# Altium schematic sheet RT723.SchDoc
size A4; SheetNumber: 5; SheetTotal: 14
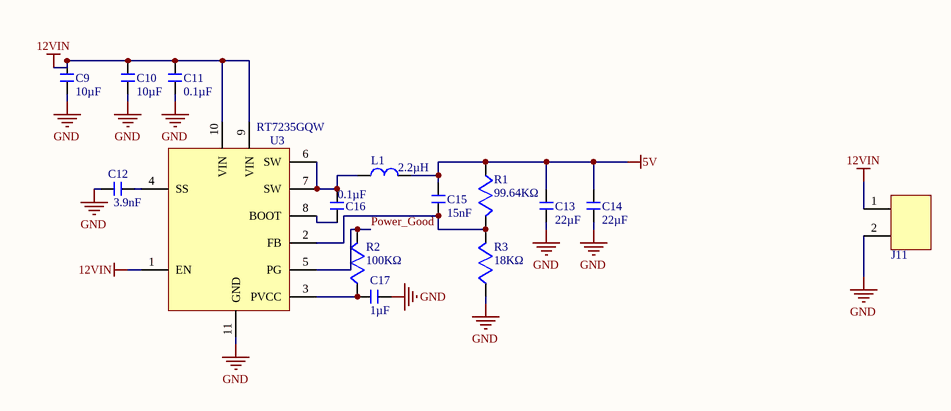
[diagram p0: RT723.SchDoc]

## Parts
C9  value 10µF  [603 CAPACITOR]  (hidden comment: 0603 CAPACİTOR)
C10  value 10µF  [603 CAPACITOR]  (hidden comment: 0603 CAPACİTOR)
C11  value 0.1µF  [402 capacitor - duplicate]  (hidden comment: 0402 capacitor)
C12  value 3.9nF  [402 capacitor - duplicate]  (hidden comment: 0402 capacitor)
C13  value 22µF  [805 Capacitor - duplicate]  (hidden comment: 0805 capacitor)
C14  value 22µF  [805 Capacitor - duplicate]  (hidden comment: 0805 capacitor)
C15  value 15nF  [402 capacitor - duplicate]  (hidden comment: 0402 capacitor)
C16  value 0.1µF  [402 capacitor - duplicate]  (hidden comment: 0402 capacitor)
C17  value 1µF  [402 capacitor - duplicate]  (hidden comment: 0402 capacitor)
J11  0901362102  [0901362102]  (value not drawn)
L1  value 2.2µH  [INDUCTOR_2]  (hidden comment: BRL2518T2R2M)
R1  value 99.64KΩ  [402 RESISTOR]  (hidden comment: 0402. RESİSTOR)
R2  value 100KΩ  [402 RESISTOR]  (hidden comment: 0402. RESİSTOR)
R3  value 18KΩ  [402 RESISTOR]  (hidden comment: 0402. RESİSTOR)
U3  RT7235GQW  [RT7235GQW]

## Nets
5V: C13.2 C14.2 C15.1 L1.2 R1.1
12VIN: C9.2 C10.2 C11.2 J11.1 U3.1(EN) U3.9(VIN) U3.10(VIN)
GND: C9.1 C10.1 C11.1 C12.2 C13.1 C14.1 C17.2 J11.2 R3.1 U3.11(GND)
Power_Good: R2.2 U3.5(PG)
NetC12_1: C12.1 U3.4(SS)
NetC15_2: C15.2 R1.2 R3.2 U3.2(FB)
NetC16_1: C16.1 L1.1 U3.6(SW) U3.7(SW)
NetC16_2: C16.2 U3.8(BOOT)
NetC17_1: C17.1 R2.1 U3.3(PVCC)

## Library data of the parts
C9 C10 = CON SMD 0603: MPN: GRM188R61E106MA73D; Pacage: 0603
C11 C16 = CAP SMD 402: MPN: CL05A104KA5NNNC; Package: 0402
C12 = CAP SMD 402: MPN: C0603C392J3GACTU; Package: 0402
C13 C14 = CAP SMD 0805: MPN: CL10A226MO7JZNC; Package: 0805
C15 = CAP SMD 402: MPN: C0402C153J5RECTU; Package: 0402
C17 = CAP SMD 402: MPN: GRM155R6YA105KE11D; Package: 0402
J11 = 0901362102: CONN HEADER R/A 2POS 2.54MM; MPN: 0901362102
L1 = BRL2518T2R2M: FIXED IND 2.2UH 850MA 175.5 MOHM; MPN: BRL2518T2R2M
R1 = RES SMD 0402: Package: 0402
R2 = RES SMD 0402: MPN: ERJ-2RKF1003X; Package: 0402
R3 = RES SMD 0402: MPN: ERA-2AEB183X; Package: 0402
U3 = RT7235GQW: IC REG BUCK ADJ 5A 10WDFN; MPN: RT7235GQW